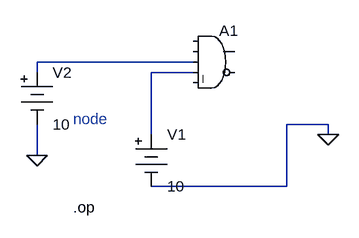
[diagram p0: schematic and.asc]
and.asc, the LTspice schematic file:
Version 4
SHEET 1 880 680
WIRE 112 160 -128 160
WIRE -128 176 -128 160
WIRE 112 176 48 176
WIRE 320 256 256 256
WIRE 48 272 48 176
WIRE 320 272 320 256
WIRE -128 304 -128 256
WIRE 256 352 256 256
WIRE 256 352 48 352
FLAG 320 272 0
FLAG -128 304 0
SYMBOL Digital\\and 144 96 R0
SYMATTR InstName A1
SYMATTR Value2 1
SYMBOL Misc\\battery 48 256 R0
WINDOW 123 0 0 Left 0
WINDOW 39 0 0 Left 0
SYMATTR InstName V1
SYMATTR Value 10
SYMBOL Misc\\battery -128 160 R0
SYMATTR InstName V2
SYMATTR Value 10
TEXT -72 248 Left 2 ;node
TEXT -72 384 Left 2 !.op

The netlist it stands for:
* and.asc
A1 0 0 N001 N002 0 0 0 0 AND 1
V1 N002 0 10
V2 N001 0 10
* node
.op
.backanno
.end